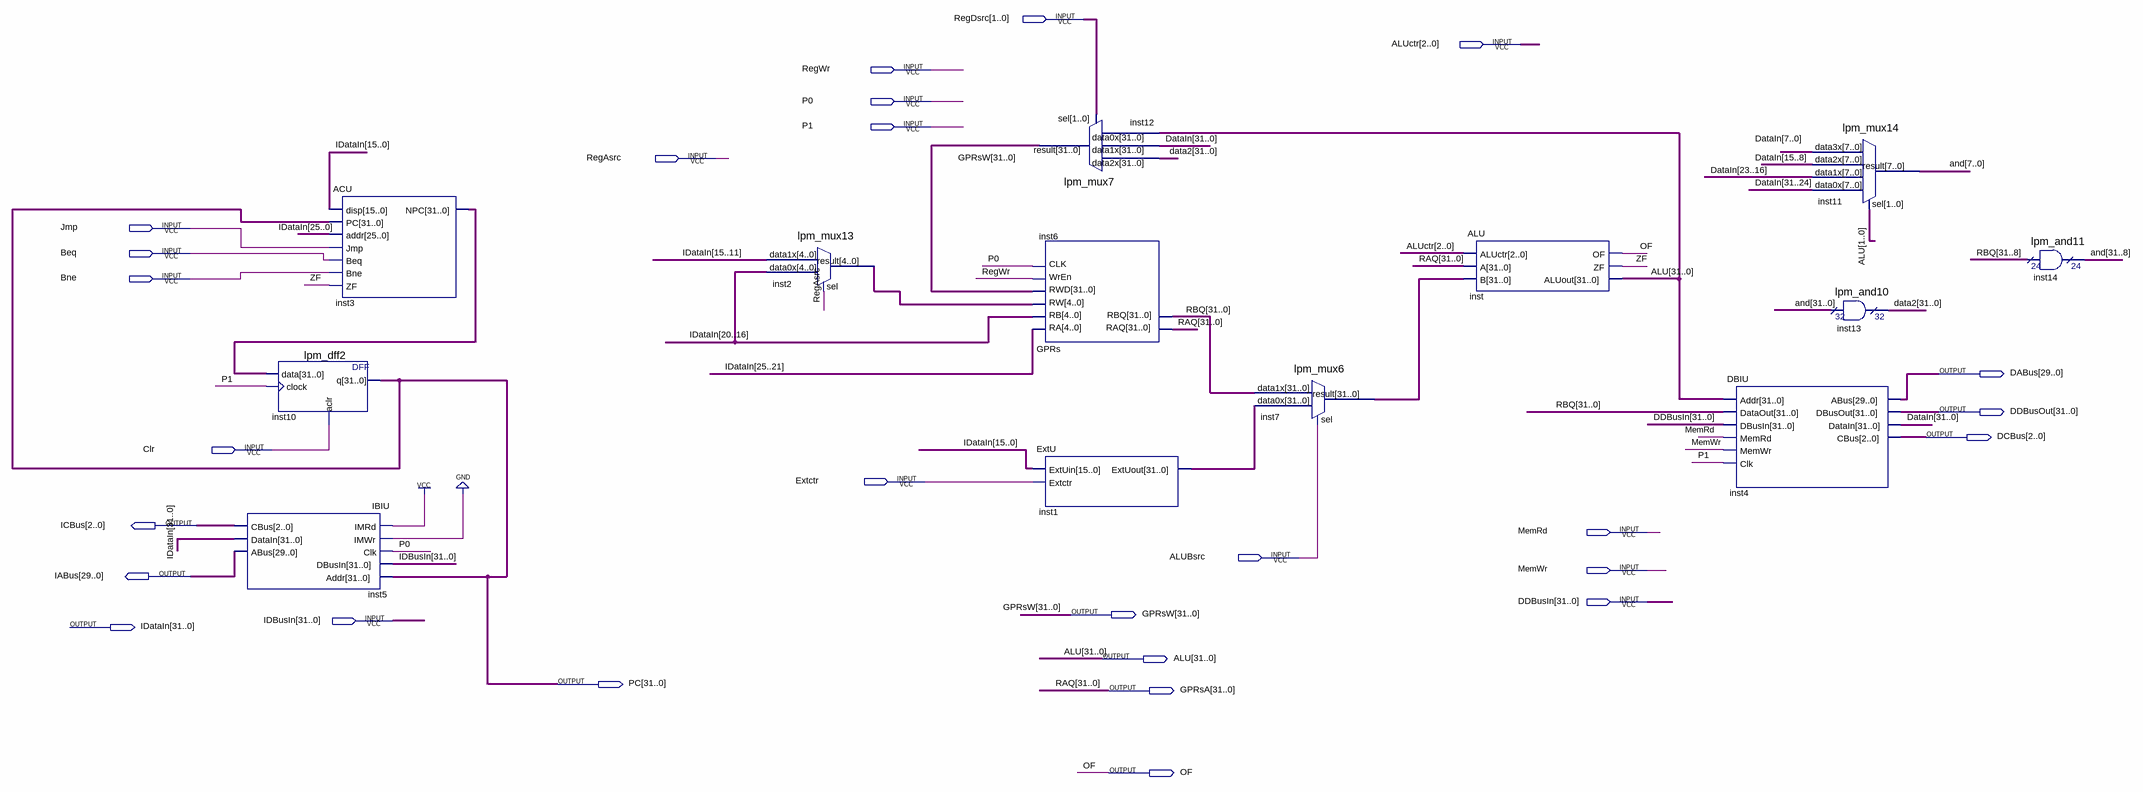
[diagram p0: schematic sheet]
// Quartus schematic DataPath.bdf as structural Verilog: 13 symbols, 27 pins
module DataPath (
  input  [1:0] RegDsrc,
  input  [2:0] ALUctr,
  input  RegWr,
  input  P0,
  input  P1,
  input  RegAsrc,
  input  Jmp,
  input  Beq,
  input  Bne,
  input  Clr,
  input  Extctr,
  input  MemRd,
  input  ALUBsrc,
  input  MemWr,
  input  [31:0] DDBusIn,
  input  [31:0] IDBusIn,
  output [29:0] DABus,
  output [31:0] DDBusOut,
  output [2:0] DCBus,
  output [2:0] ICBus,
  output [29:0] IABus,
  output [31:0] GPRsW,
  output [31:0] IDataIn,
  output [31:0] ALU,
  output [31:0] PC,
  output [31:0] GPRsA,
  output OF
);

  wire ZF;
  wire [4:0] inst2_result;
  wire [31:0] \and , data2, DataIn, inst1_extuout, inst3_npc, inst7_result, RBQ;

  IBIU inst5 (
    .IMRd(1'b1), .IMWr(1'b0), .Clk(P0), .DBusIn(IDBusIn), .Addr(PC), .CBus(ICBus), .DataIn(IDataIn),
    .ABus(IABus));
  lpm_dff2 inst10 (.data(inst3_npc), .clock(P1), .aclr(Clr), .q(PC));
  ACU inst3 (
    .disp(IDataIn[15:0]), .PC(PC), .addr(IDataIn[25:0]), .Jmp(Jmp), .Beq(Beq), .Bne(Bne), .ZF(ZF),
    .NPC(inst3_npc));
  lpm_mux13 inst2 (.data1x(IDataIn[15:11]), .data0x(IDataIn[20:16]), .sel(RegAsrc), .result(inst2_result));
  lpm_mux7 inst12 (.data2x(data2), .data1x(DataIn), .data0x(ALU), .sel(RegDsrc), .result(GPRsW));
  GPRs inst6 (
    .RA(IDataIn[25:21]), .RB(IDataIn[20:16]), .RW(inst2_result), .RWD(GPRsW), .WrEn(RegWr), .CLK(P0),
    .RAQ(GPRsA), .RBQ(RBQ));
  ExtU inst1 (.ExtUin(IDataIn[15:0]), .Extctr(Extctr), .ExtUout(inst1_extuout));
  lpm_mux6 inst7 (.data1x(RBQ), .data0x(inst1_extuout), .sel(ALUBsrc), .result(inst7_result));
  ALU inst (.ALUctr(ALUctr), .A(GPRsA), .B(inst7_result), .OF(OF), .ZF(ZF), .ALUout(ALU));
  DBIU inst4 (
    .Addr(ALU), .DataOut(RBQ), .DBusIn(DDBusIn), .MemRd(MemRd), .MemWr(MemWr), .Clk(P1), .ABus(DABus),
    .DBusOut(DDBusOut), .DataIn(DataIn), .CBus(DCBus));
  lpm_mux14 inst11 (
    .data3x(DataIn[7:0]), .data2x(DataIn[15:8]), .data1x(DataIn[23:16]), .data0x(DataIn[31:24]),
    .sel(ALU[1:0]), .result(\and [7:0]));
  lpm_and10 inst13 (.data0x(\and ), .result(data2));
  lpm_and11 inst14 (.data0x(RBQ[31:8]), .result(\and [31:8]));

  // Other names for the same wires on the sheet: RAQ[31:0] = GPRsA

  // Notes on the sheet:
  //   .;
endmodule
